# EAGLE design pwr_part (EAGLE 7.2.0)
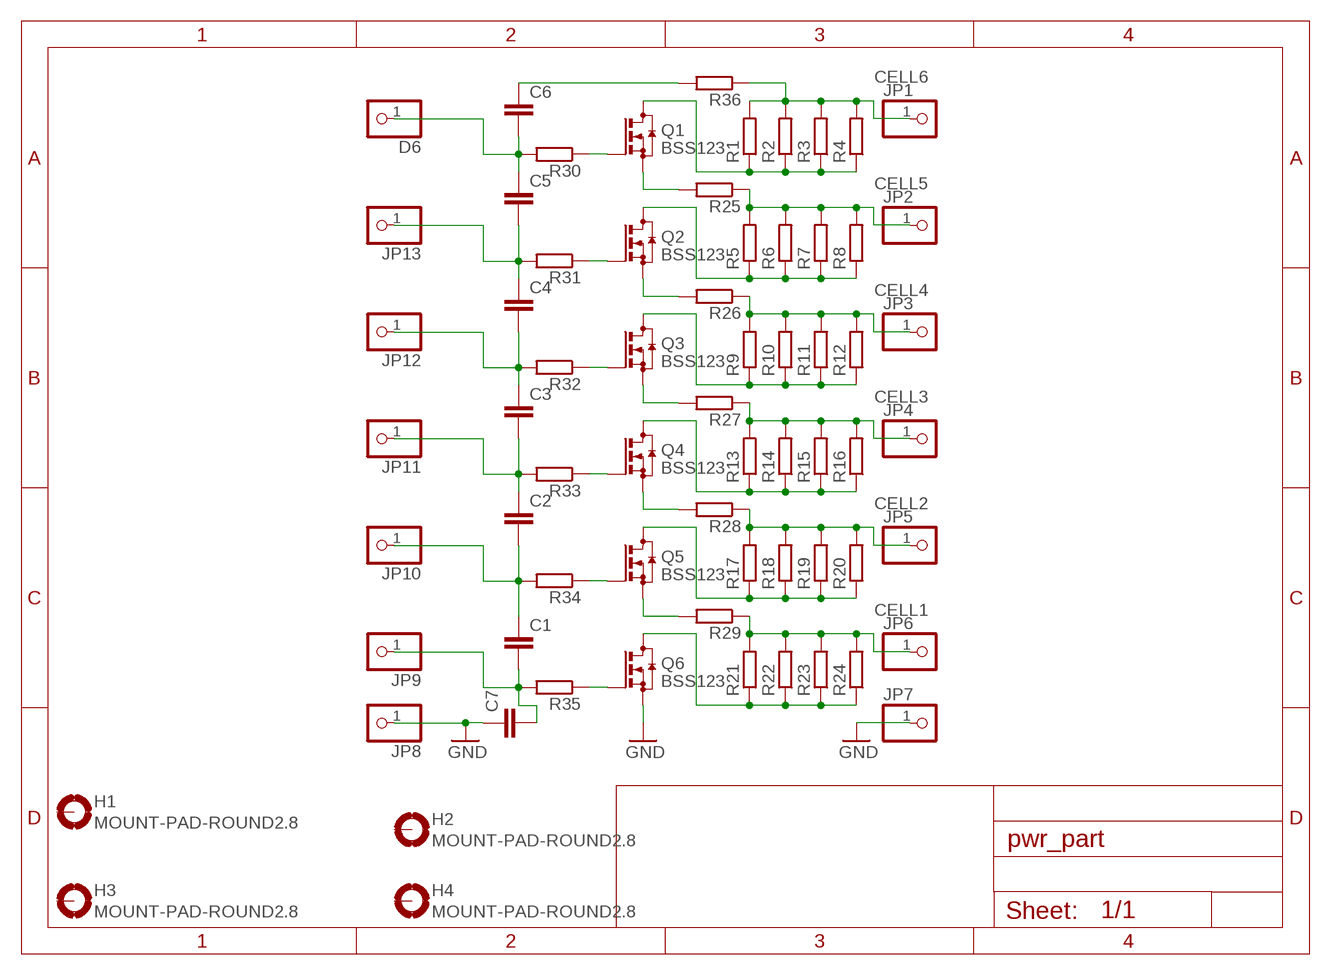
[diagram p0: schematic, sheet 1]

## Parts
C1  C-EUC0805K  [C0805K]
C2  C-EUC0805K  [C0805K]
C3  C-EUC0805K  [C0805K]
C4  C-EUC0805K  [C0805K]
C5  C-EUC0805K  [C0805K]
C6  C-EUC0805K  [C0805K]
C7  C-EUC0805K  [C0805K]
D6  PINHD-1X1  [1X01]
H1  MOUNT-PAD-ROUND2.8  [2,8-PAD]
H2  MOUNT-PAD-ROUND2.8  [2,8-PAD]
H3  MOUNT-PAD-ROUND2.8  [2,8-PAD]
H4  MOUNT-PAD-ROUND2.8  [2,8-PAD]
JP1  PINHD-1X1  [1X01]
JP2  PINHD-1X1  [1X01]
JP3  PINHD-1X1  [1X01]
JP4  PINHD-1X1  [1X01]
JP5  PINHD-1X1  [1X01]
JP6  PINHD-1X1  [1X01]
JP7  PINHD-1X1  [1X01]
JP8  PINHD-1X1  [1X01]
JP9  PINHD-1X1  [1X01]
JP10  PINHD-1X1  [1X01]
JP11  PINHD-1X1  [1X01]
JP12  PINHD-1X1  [1X01]
JP13  PINHD-1X1  [1X01]
Q1  BSS123  [SOT23]
Q2  BSS123  [SOT23]
Q3  BSS123  [SOT23]
Q4  BSS123  [SOT23]
Q5  BSS123  [SOT23]
Q6  BSS123  [SOT23]
R1  R-EU_R1206  [R1206]
R2  R-EU_R1206  [R1206]
R3  R-EU_R1206  [R1206]
R4  R-EU_R1206  [R1206]
R5  R-EU_R1206  [R1206]
R6  R-EU_R1206  [R1206]
R7  R-EU_R1206  [R1206]
R8  R-EU_R1206  [R1206]
R9  R-EU_R1206  [R1206]
R10  R-EU_R1206  [R1206]
R11  R-EU_R1206  [R1206]
R12  R-EU_R1206  [R1206]
R13  R-EU_R1206  [R1206]
R14  R-EU_R1206  [R1206]
R15  R-EU_R1206  [R1206]
R16  R-EU_R1206  [R1206]
R17  R-EU_R1206  [R1206]
R18  R-EU_R1206  [R1206]
R19  R-EU_R1206  [R1206]
R20  R-EU_R1206  [R1206]
R21  R-EU_R1206  [R1206]
R22  R-EU_R1206  [R1206]
R23  R-EU_R1206  [R1206]
R24  R-EU_R1206  [R1206]
R25  R-EU_0411/3V  [0411V]
R26  R-EU_0411/3V  [0411V]
R27  R-EU_0411/3V  [0411V]
R28  R-EU_0411/3V  [0411V]
R29  R-EU_0411/3V  [0411V]
R30  R-EU_R1206  [R1206]
R31  R-EU_R1206  [R1206]
R32  R-EU_R1206  [R1206]
R33  R-EU_R1206  [R1206]
R34  R-EU_R1206  [R1206]
R35  R-EU_R1206  [R1206]
R36  R-EU_0411/3V  [0411V]

## Nets
CELL1: JP6.1 R21.2 R22.2 R23.2 R24.2 R29.1
CELL2: JP5.1 R17.2 R18.2 R19.2 R20.2 R28.1
CELL3: JP4.1 R13.2 R14.2 R15.2 R16.2 R27.1
CELL4: JP3.1 R9.2 R10.2 R11.2 R12.2 R26.1
CELL5: JP2.1 R5.2 R6.2 R7.2 R8.2 R25.1
CELL6: JP1.1 R1.2 R2.2 R3.2 R4.2 R36.1
D5: C4.1 C5.2 JP13.1 R31.2
GND: C7.1 JP7.1 JP8.1 Q6.2(S)
N$1: Q1.3(D) R1.1 R2.1 R3.1 R4.1
N$2: C6.1 R36.2
N$4: Q2.3(D) R5.1 R6.1 R7.1 R8.1
N$6: Q3.3(D) R9.1 R10.1 R11.1 R12.1
N$8: Q4.3(D) R13.1 R14.1 R15.1 R16.1
N$9: Q5.3(D) R17.1 R18.1 R19.1 R20.1
N$11: Q6.3(D) R21.1 R22.1 R23.1 R24.1
N$13: Q2.2(S) R26.2
N$14: Q3.2(S) R27.2
N$15: Q4.2(S) R28.2
N$16: Q5.2(S) R29.2
N$17: Q1.1(G) R30.1
N$18: Q1.2(S) R25.2
N$19: Q2.1(G) R31.1
N$20: Q3.1(G) R32.1
N$21: Q4.1(G) R33.1
N$22: Q5.1(G) R34.1
N$23: Q6.1(G) R35.1
N$24: C5.1 C6.2 D6.1 R30.2
N$26: C3.1 C4.2 JP12.1 R32.2
N$27: C2.1 C3.2 JP11.1 R33.2
N$28: C1.1 C2.2 JP10.1 R34.2
N$29: C1.2 C7.2 JP9.1 R35.2
Unconnected: H1.B2,8(MOUNT) H2.B2,8(MOUNT) H3.B2,8(MOUNT) H4.B2,8(MOUNT)

## Library data of the parts
C1-C7 = rcl:C-EU: CAPACITOR, European symbol
D6 JP1-JP13 = pinhead:PINHD-1X1: PIN HEADER
H1-H4 = holes:MOUNT-PAD-ROUND: MOUNTING PAD, round
Q1-Q6 = transistor-small-signal:BSS123: N-CHANNEL MOS FET
R1-R36 = rcl:R-EU_: RESISTOR, European symbol

## Board
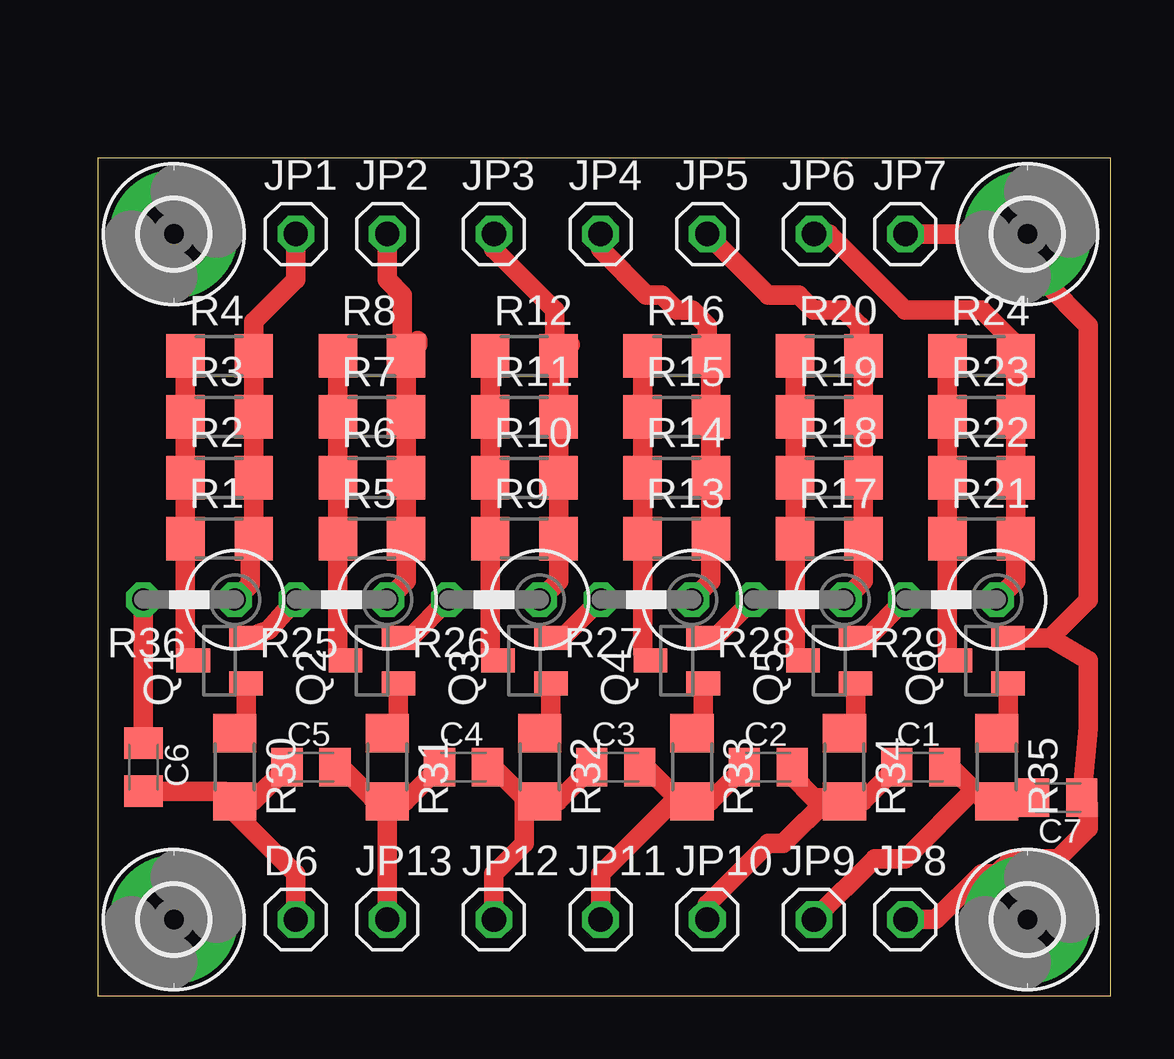
[diagram p1: board, top side]
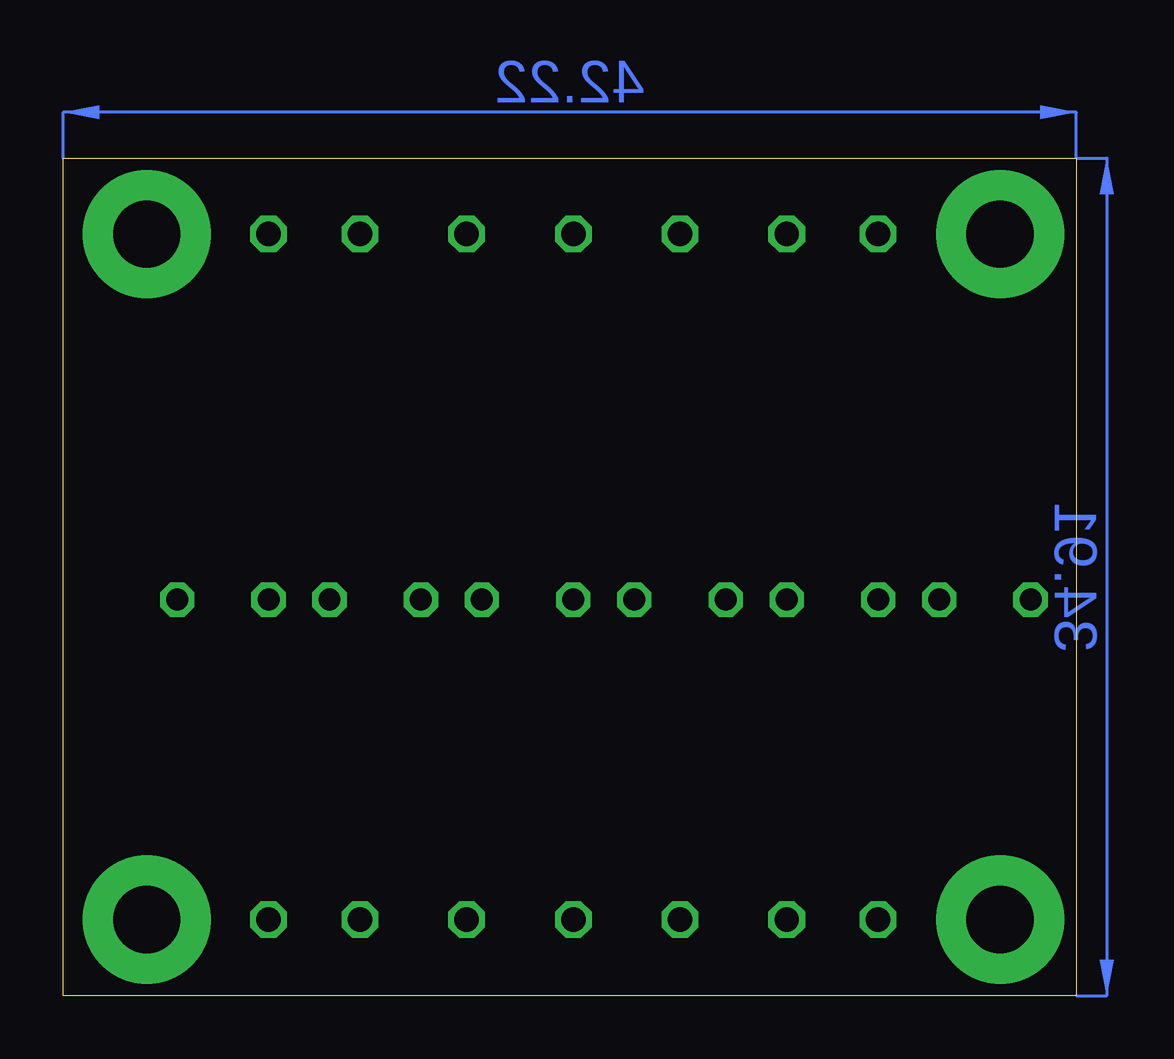
[diagram p2: board, bottom side, seen from below]

Size 42.22 x 34.91 mm. Coordinates in mm from the lower left corner, seen from the top.
Outline: 0,0 42.22,0 42.22,34.91 0,34.91 0,0
Copper layers (1*16): Top 0.035mm / dielectric 1.5mm / Bottom 0.035mm
Design rules "default": minimum track width 10mil, minimum drill 24mil, track to track 8mil, track to pad 8mil, pad to pad 8mil, via to via 8mil, smd to smd 8mil, copper to edge 40mil, drill to drill 8mil, minimum pad ring 10mil, minimum via ring 8mil, stop-mask expansion 4mil, vias tented up to drill 0mil, thermal gap 10mil

### Footprints (pad centres in the part's own frame; a part is rotated, then mirrored left to right if it is on the bottom)
C0805K = smd 1.3 x 1.6: 1 -1,0; 2 1,0
1X01 = drill 1.016 octagon: 1 0,0
2,8-PAD = drill 2.8 pad 5.334: B2,8 0,0
SOT23 = smd 1 x 1.4: 1 -0.95,-1.1; 2 0.95,-1.1; 3 0,1.1
R1206 = smd 1.6 x 1.803: 1 -1.422,0; 2 1.422,0
0411V = drill 0.914 octagon: 1 -2.54,0; 2 1.27,0

### Placement (x,y rotation side)
C1  34.29,9.53 0 top
C2  27.94,9.53 0 top
C3  21.59,9.53 0 top
C4  15.24,9.53 0 top
C5  8.89,9.53 0 top
C6  1.91,9.53 270 top
C7  40.01,8.26 180 top
D6  8.26,3.17 0 top
H1  3.17,31.75 0 top
H2  3.17,3.17 0 top
H3  38.73,3.17 0 top
H4  38.73,31.75 0 top
JP1  8.26,31.75 0 top
JP2  12.06,31.75 0 top
JP3  16.51,31.75 0 top
JP4  20.95,31.75 0 top
JP5  25.4,31.75 0 top
JP6  29.84,31.75 0 top
JP7  33.66,31.75 0 top
JP8  33.66,3.17 0 top
JP9  29.84,3.17 0 top
JP10  25.4,3.17 0 top
JP11  20.95,3.17 0 top
JP12  16.51,3.17 0 top
JP13  12.06,3.17 0 top
Q1  5.08,13.97 90 top
Q2  11.43,13.97 90 top
Q3  17.78,13.97 90 top
Q4  24.13,13.97 90 top
Q5  30.48,13.97 90 top
Q6  36.83,13.97 90 top
R1  5.08,19.05 0 top
R2  5.08,21.59 0 top
R3  5.08,24.13 0 top
R4  5.08,26.67 0 top
R5  11.43,19.05 0 top
R6  11.43,21.59 0 top
R7  11.43,24.13 0 top
R8  11.43,26.67 0 top
R9  17.78,19.05 0 top
R10  17.78,21.59 0 top
R11  17.78,24.13 0 top
R12  17.78,26.67 0 top
R13  24.13,19.05 0 top
R14  24.13,21.59 0 top
R15  24.13,24.13 0 top
R16  24.13,26.67 0 top
R17  30.48,19.05 0 top
R18  30.48,21.59 0 top
R19  30.48,24.13 0 top
R20  30.48,26.67 0 top
R21  36.83,19.05 0 top
R22  36.83,21.59 0 top
R23  36.83,24.13 0 top
R24  36.83,26.67 0 top
R25  9.53,16.51 180 top
R26  15.88,16.51 180 top
R27  22.23,16.51 180 top
R28  28.57,16.51 180 top
R29  34.92,16.51 180 top
R30  5.71,9.53 270 top
R31  12.06,9.53 270 top
R32  18.41,9.53 270 top
R33  24.77,9.53 270 top
R34  31.11,9.53 270 top
R35  37.47,9.53 270 top
R36  3.17,16.51 180 top

### Tracks (layer width: path | path; a pad name or v marks a point on that pad's centre or on a via)
CELL1
  Top 0.813: R29.1 38.25,17.3 R21.2 R22.2 R23.2 R24.2 38.1,26.82 38.1,27.3 36.83,28.57 33.66,28.57 30.48,31.75 JP6.1
CELL2
  Top 0.813: R28.1 31.9,17.3 R17.2 R18.2 R19.2 R20.2 31.75,26.82 31.75,27.94 31.11,28.57 29.84,28.57 29.21,29.21 27.94,29.21 JP5.1
CELL3
  Top 0.813: R27.1 25.55,17.3 R13.2 R14.2 R15.2 R16.2 25.4,26.82 25.4,27.94 24.77,28.57 24.13,28.57 23.5,29.21 22.86,29.21 20.95,31.11 JP4.1
CELL4
  Top 0.813: R12.2 R11.2 R10.2 R9.2 19.2,17.3 R26.1 | 19.68,27.15 R12.2 | JP3.1 16.51,31.11 19.05,28.57 19.05,26.82 R12.2
CELL5
  Top 0.813: R8.2 R7.2 R6.2 R5.2 12.85,17.3 R25.1 | 13.34,27.3 13.34,27.15 R8.2 | JP2.1 12.06,29.84 12.7,29.21 12.7,26.82 R8.2
CELL6
  Top 0.813: R36.1 6.35,17.14 6.35,18.9 R1.2 R2.2 R3.2 R4.2 6.5,28.09 8.26,29.84 JP1.1
D5
  Top 0.813: C5.2 10.16,9.53 11.43,8.26 11.91,8.26 R31.2 | R31.2 12.82,8.1 C4.1 | R31.2 JP13.1
GND
  Top 0.813: Q6.2 39.69,14.92 | 39.69,14.92 41.27,13.97 41.27,11.16 C7.1 41.27,7.99 41.27,6.99 40.01,5.71 38.1,5.71 37.47,5.08 36.83,5.08 34.92,3.17 JP8.1 | JP7.1 36.2,31.75 38.1,29.84 39.37,29.84 41.27,27.94 41.27,16.5 39.69,14.92
N$1
  Top 0.813: R4.1 R3.1 R2.1 R1.1 3.66,14.29 Q1.3
N$2
  Top 0.813: R36.2 C6.1
N$4
  Top 0.813: R8.1 R7.1 R6.1 R5.1 10.01,14.29 Q2.3
N$6
  Top 0.813: R12.1 R11.1 R10.1 R9.1 16.36,14.29 Q3.3
N$8
  Top 0.813: R16.1 R15.1 R14.1 | R14.1 22.71,21.11 22.86,20.95 22.86,21.44 R14.1 | R14.1 R13.1 22.71,14.29 Q4.3
N$9
  Top 0.813: R20.1 R19.1 R18.1 R17.1 29.06,14.29 Q5.3
N$11
  Top 0.813: R24.1 R23.1 R22.1 R21.1 35.41,14.29 Q6.3
N$13
  Top 0.813: Q2.2 13.02,14.92 R26.2
N$14
  Top 0.813: Q3.2 19.36,14.92 R27.2
N$15
  Top 0.813: Q4.2 25.71,14.92 R28.2
N$16
  Top 0.813: Q5.2 32.06,14.92 R29.2
N$17
  Top 0.813: Q1.1 6.18,11.41 R30.1
N$18
  Top 0.813: R25.2 7.13,15.24 Q1.2
N$19
  Top 0.813: Q2.1 12.53,11.41 R31.1
N$20
  Top 0.813: Q3.1 18.88,11.41 R32.1
N$21
  Top 0.813: Q4.1 25.23,11.41 R33.1
N$22
  Top 0.813: Q5.1 31.58,11.41 R34.1
N$23
  Top 0.813: Q6.1 37.93,11.41 R35.1
N$24
  Top 0.813: C6.2 5.29,8.53 R30.2 | R30.2 6.47,8.1 C5.1 | R30.2 5.71,7.62 8.26,5.08 D6.1
N$26
  Top 0.813: C4.2 16.51,9.53 17.78,8.26 | 17.78,8.26 18.26,8.26 R32.2 19.17,8.1 C3.1 | 17.78,8.26 17.78,6.35 16.51,5.08 JP12.1
N$27
  Top 0.813: C3.2 22.86,9.53 24.13,8.26 | 24.13,8.26 24.61,8.26 R33.2 25.52,8.1 C2.1 | 24.13,8.26 20.95,5.08 JP11.1
N$28
  Top 0.813: C2.2 28.94,9.16 29.84,8.26 30.48,8.26 | 30.48,8.26 30.96,8.26 R34.2 31.87,8.1 C1.1 | JP10.1 25.4,3.81 27.94,6.35 28.57,6.35 30.48,8.26
N$29
  Top 0.813: C1.2 35.56,9.53 36.51,8.57 | 36.51,8.57 36.83,8.26 37.31,8.26 R35.2 38.22,8.1 C7.2 | JP9.1 32.38,5.71 33.66,5.71 36.51,8.57
(copper drawn outside any net)
  shapes: Bottom area x2